# Altium project SAMR21_Xplained_Pro.PrjPCB (part 2 of 2)

## Sheet SAMR21_Xplained_Pro_Antenna.SchDoc: Antenna
size A3; Organization: ATMEL Norway; Address1: Vestre Rosten 79; Address2: N-7075 TILLER; Address3: NORWAY; DocumentNumber: A09-2127; Revision: 3; SheetNumber: 4; SheetTotal: 7; PageSetup: Record=PageOptions|CenterHorizontal=True|CenterVertical=True|PrintScale=0.68|XCorrection=1.00|YCorrection=1.00|PrintKind=0|BorderSize=5000000|LeftOffset=0|BottomOffset=0|Orientation=2|PaperLength=1000|PaperWidth=1000|Scale=100|PaperSource=7|PrintQuality=-4|MediaType=1|DitherType=10|PaperKind=Letter|PrintScaleMode=1
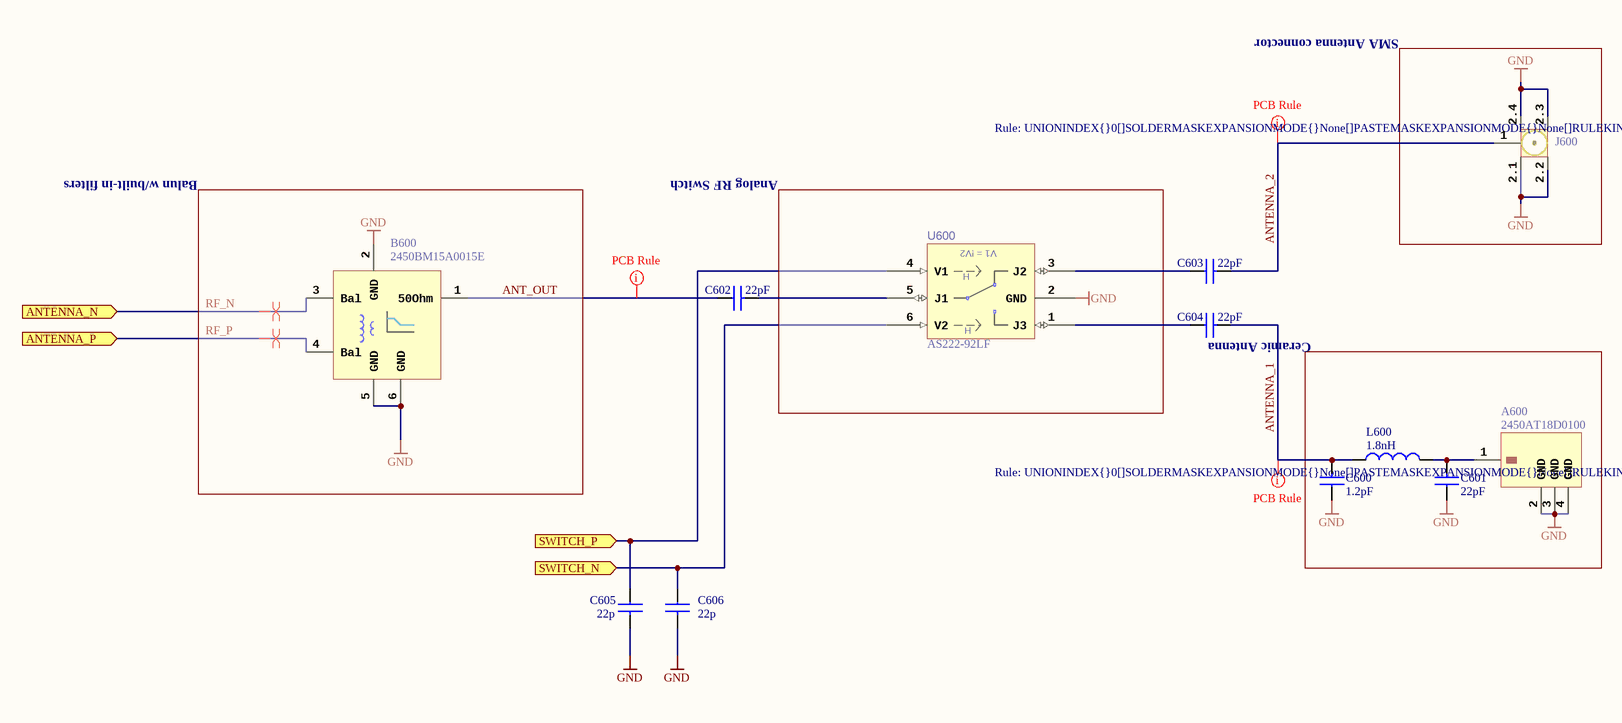
[diagram p6: SAMR21_Xplained_Pro_Antenna.SchDoc]

### Parts
A600  value 2450AT18D0100  [AP8-00678]  (hidden comment: ANT_CERAMIC_4pin)
B600  value 2450BM15A0015E  [AP3-00060]  (hidden comment: New part development in cooperation ATMEL/JTI)
C600  value 1.2pF  [AP1-00035]  (hidden comment: This 1.2pF capacitor is used for RF antennae tuning and can not be replaced by alternatives.)
C601  value 22pF  [AP1-00035]  (hidden comment: This 22pF capacitor cannot be replaced by A01-0311 in ZigBits)
C602  value 22pF  [AP1-00035]  (hidden comment: This 22pF capacitor cannot be replaced by A01-0311 in ZigBits)
C603  value 22pF  [AP1-00035]  (hidden comment: This 22pF capacitor cannot be replaced by A01-0311 in ZigBits)
C604  value 22pF  [AP1-00035]  (hidden comment: This 22pF capacitor cannot be replaced by A01-0311 in ZigBits)
C605  value 22p  [AP1-00001]  (hidden comment: CAP-NONPOL)
C606  value 22p  [AP1-00001]  (hidden comment: CAP-NONPOL)
J600  Footprint fits SPC, Tyco and Johnson components footprint  [AP8-00416]  (value not drawn)
L600  value 1.8nH  [AP2-00028]  (hidden comment: INDUCTOR)
U600  value AS222-92LF  [AP6-00227]  (hidden comment: AS222-92)

### Blocks framed on the sheet
SMA Antenna connector: J600
Balun w/built-in filters: B600
Analog RF Switch: U600
Ceramic Antenna: A600 C600 C601 L600

### Ports
ANTENNA_N (in), ANTENNA_P (in), SWITCH_N (in), SWITCH_P (in)

### Nets
GND: A600.2(GND) A600.3(GND) A600.4(GND) B600.2(GND) B600.5(GND) B600.6(GND) C600.1 C601.1 C605.2 C606.2 J600.2.1(GND1) J600.2.2(GND2) J600.2.3(GND3) J600.2.4(GND4) U600.2(GND)
ANT_OUT: B600.1(50Ohm) C602.1
ANTENNA_1: C600.2 C604.2 L600.2
ANTENNA_2: C603.2 J600.1(Core)
PA09_RFCTRL1: C606.1 U600.6(V2) ; port SWITCH_N
PA12_RFCTRL2: C605.1 U600.4(V1) ; port SWITCH_P
RF_N: B600.3(Bal) ; port ANTENNA_N
RF_P: B600.4(Bal) ; port ANTENNA_P
NetA600_1: A600.1(A) C601.2 L600.1
NetC602_2: C602.2 U600.5(J1)
NetC603_1: C603.1 U600.3(J2)
NetC604_1: C604.1 U600.1(J3)

### Layout directives
differential pair: RF_N, RF_P
rule Impedance Constraint [Min = 48.00    Max = 52.00    ]: ANT_OUT, ANTENNA_1, ANTENNA_2

### Notes on the sheet
- Date:
- PAGE:
- of
- TITLE:
- Document number:
- Revision:
- (in symbol A06-0560) V1 = !V2; H

### Library data of the parts
A600 = A08-1618: 2.45 GHz Ceramic Antenna; PartGroup: Mechanical devices,Antenna; Manufacturer: Johanson Technology; TemperatureRange: -40 to +85°C; AN: A08-1618; Height: 1.39999997615814; MPN: 2450AT18D0100
B600 = A03-0091: Filtered Balun to match AT86RF232/233 (35288); PartGroup: Inductors,RF,Other RF; Manufacturer: Johanson Technology; AN: A03-0091; Height: 0,800000011920929; MPN: 2450BM15A0015E
C600 = A01-0612: Ceramic Capacitor, SMD 0201, 25V, NP0, 1.2pF; PartGroup: Capacitors,Ceramic,SMD 0201; AN: A01-0612
C601-C604 = A01-0335: Ceramic Capacitor, SMD 0201, 25V, NP0, 22PF; PartGroup: Capacitors,Ceramic,SMD 0201; Manufacturer: Johanson Technology; MPN: 250R05L220JV4T; AN: A01-0335
C605 C606 = A01-0019: Ceramic capacitor, SMD 0402, NP0, 50V, +/-5%; PartGroup: Capacitors,Ceramic,SMD 0402; TemperatureRange: -55 - +125 deg C; AN: A01-0019; Tolerance: 50V, +/-5%; Height: 0.550000011920929
J600 = A08-0963: SMA PCB mounted connector 50Ohm (de19205); PartGroup: Mechanical devices,Connectors,Coaxial; Manufacturer: Multicomp; Value: 19-46-1-TGG; TemperatureRange: -65 - +165 deg C; AN: A08-0963; MPN: 19-46-1-TGG; Height: 13
L600 = A03-0148: ceramic chip inductor, 1.8nH,0201; PartGroup: Inductors,RF,SMD 0201; Manufacturer: Johanson Technology; MPN: L-05B1N8SV6T; Tolerance: ±0.3nH; TemperatureRange: -40°C ~ 100°C; AN: A03-0148
U600 = A06-0560: PHEMT SPDT Analog SWITCH, 0,1-3 GHz; PartGroup: Integrated Circuits,General linear,Analog switch, bus switch and MUX; Manufacturer: SKYWORKS SOLUTIONS; TemperatureRange: -40°C to +85°C; AN: A06-0560; Height: 0,949999988079071; MPN: AS222-92LF

## Nets that join several sheets
GND: SAMR21_Xplained_Pro_Target_MCU (30 pins), SAMR21_Xplained_Pro_Crystals (7 pins), SAMR21_Xplained_Pro_EDBG (33 pins), SAMR21_Xplained_Pro_Connectors (J200.2 J200.19 J202.2 J202.19), SAMR21_Xplained_Pro_triple_input_power_supply (16 pins), SAMR21_Xplained_Pro_Antenna (15 pins)
VCC_EDBG_USB_P5V0: SAMR21_Xplained_Pro_EDBG (C408.1 L401.2 U400.A10), SAMR21_Xplained_Pro_triple_input_power_supply (C102.1 R104.2 U101.3 U101.8)
VCC_MCU_P3V3: SAMR21_Xplained_Pro_Target_MCU (9 pins), SAMR21_Xplained_Pro_triple_input_power_supply (J101.1)
VCC_P3V3: SAMR21_Xplained_Pro_EDBG (R425.2), SAMR21_Xplained_Pro_triple_input_power_supply (C100.1 R102.1 R108.1 U100.5)
VCC_TARGET_P3V3: SAMR21_Xplained_Pro_Target_MCU (J303.1 R300.2 R303.2), SAMR21_Xplained_Pro_Connectors (J200.20 J202.20), SAMR21_Xplained_Pro_triple_input_power_supply (J100.4 J101.2 R108.2 R109.2)
VCC_TARGET_USB_P5V0: SAMR21_Xplained_Pro_Target_MCU (D300.4 J300.1 R328.2), SAMR21_Xplained_Pro_triple_input_power_supply (C103.1 R105.2 U101.6)
EDBG_ADC0: SAMR21_Xplained_Pro_EDBG (U400.K10), SAMR21_Xplained_Pro_triple_input_power_supply (R109.1 R110.2)
EDBG_CDC_USART_RX: SAMR21_Xplained_Pro_Target_MCU (R316.1), SAMR21_Xplained_Pro_EDBG (U400.F9)
EDBG_DGI_SCL: SAMR21_Xplained_Pro_Target_MCU (R315.1), SAMR21_Xplained_Pro_EDBG (U400.F7)
EDBG_DGI_SDA: SAMR21_Xplained_Pro_Target_MCU (R314.1), SAMR21_Xplained_Pro_EDBG (U400.G7)
EDBG_SPI_DGI_MOSI: SAMR21_Xplained_Pro_Target_MCU (R312.1), SAMR21_Xplained_Pro_EDBG (U400.K3)
EDBG_SPI_DGI_SCK: SAMR21_Xplained_Pro_Target_MCU (R311.1), SAMR21_Xplained_Pro_EDBG (U400.J4)
EDBG_SPI_DGI_SS: SAMR21_Xplained_Pro_Target_MCU (R310.1), SAMR21_Xplained_Pro_EDBG (U400.G5)
ID1: SAMR21_Xplained_Pro_EDBG (R409.1 U400.A1), SAMR21_Xplained_Pro_Connectors (J200.1)
ID3: SAMR21_Xplained_Pro_EDBG (R401.1 U400.B3), SAMR21_Xplained_Pro_Connectors (J202.1)
NetJ200_4: SAMR21_Xplained_Pro_Target_MCU (R332.2), SAMR21_Xplained_Pro_Connectors (J200.4)
NetR313_1: SAMR21_Xplained_Pro_Target_MCU (R313.1), SAMR21_Xplained_Pro_EDBG (R420.2)
NetR317_1: SAMR21_Xplained_Pro_Target_MCU (R317.1), SAMR21_Xplained_Pro_EDBG (R414.1)
NetR318_1: SAMR21_Xplained_Pro_Target_MCU (R318.1), SAMR21_Xplained_Pro_EDBG (R416.1)
NetR319_1: SAMR21_Xplained_Pro_Target_MCU (R319.1), SAMR21_Xplained_Pro_EDBG (R417.1)
NetR320_1: SAMR21_Xplained_Pro_Target_MCU (R320.1), SAMR21_Xplained_Pro_EDBG (R418.1)
NetR321_1: SAMR21_Xplained_Pro_Target_MCU (R321.1), SAMR21_Xplained_Pro_EDBG (R419.1)
PA00_XIN32: SAMR21_Xplained_Pro_Target_MCU (U300.1), SAMR21_Xplained_Pro_Crystals (C310.1 XC301.2)
PA01_XOUT32: SAMR21_Xplained_Pro_Target_MCU (U300.2), SAMR21_Xplained_Pro_Crystals (C309.1 J301.2)
PA04_S0_UART_TX: SAMR21_Xplained_Pro_Target_MCU (R316.2 U300.9), SAMR21_Xplained_Pro_Connectors (J200.14)
PA05_S0_UART_RX: SAMR21_Xplained_Pro_Target_MCU (R317.2 U300.10), SAMR21_Xplained_Pro_Connectors (J200.13)
PA06_ADC6: SAMR21_Xplained_Pro_Target_MCU (U300.11), SAMR21_Xplained_Pro_Connectors (J200.3)
PA08_GPIO: SAMR21_Xplained_Pro_Target_MCU (R318.2 U300.15), SAMR21_Xplained_Pro_Connectors (J202.10)
PA09_RFCTRL1: SAMR21_Xplained_Pro_Target_MCU (J304.1 R319.2 U300.16), SAMR21_Xplained_Pro_Antenna (C606.1 U600.6)
PA12_RFCTRL2: SAMR21_Xplained_Pro_Target_MCU (J304.2 R320.2 U300.21), SAMR21_Xplained_Pro_Antenna (C605.1 U600.4)
PA13_GPIO: SAMR21_Xplained_Pro_Target_MCU (U300.22), SAMR21_Xplained_Pro_Connectors (J200.5)
PA14_GPIO: SAMR21_Xplained_Pro_Target_MCU (R321.2 U300.23), SAMR21_Xplained_Pro_Connectors (J202.15)
PA15_GPIO: SAMR21_Xplained_Pro_Target_MCU (U300.24), SAMR21_Xplained_Pro_Connectors (J202.5)
PA16_S1_I2C_SDA: SAMR21_Xplained_Pro_Target_MCU (R314.2 R326.2 U300.25), SAMR21_Xplained_Pro_Connectors (J200.11 J202.11)
PA17_S1_I2C_SCL: SAMR21_Xplained_Pro_Target_MCU (R315.2 R327.2 U300.26), SAMR21_Xplained_Pro_Connectors (J200.12 J202.12)
PA18_PWM_T0_W2: SAMR21_Xplained_Pro_Target_MCU (U300.27), SAMR21_Xplained_Pro_Connectors (J200.7)
PA19_PWM_T0_W3: SAMR21_Xplained_Pro_Target_MCU (R301.1 U300.28), SAMR21_Xplained_Pro_Connectors (J200.8)
PA22_GPIO: SAMR21_Xplained_Pro_Target_MCU (U300.31), SAMR21_Xplained_Pro_Connectors (J200.9)
PA23_GPIO: SAMR21_Xplained_Pro_Target_MCU (U300.32), SAMR21_Xplained_Pro_Connectors (J200.10)
PA28_GPIO: SAMR21_Xplained_Pro_Target_MCU (R306.1 U300.41), SAMR21_Xplained_Pro_Connectors (J200.6)
PB02_S5_SPI_MISO: SAMR21_Xplained_Pro_Target_MCU (R313.2 U300.47), SAMR21_Xplained_Pro_Connectors (J200.17 J202.17)
PB03_S5_SPI_SS: SAMR21_Xplained_Pro_Target_MCU (U300.48), SAMR21_Xplained_Pro_Connectors (J200.15)
PB22_S5_SPI_MOSI: SAMR21_Xplained_Pro_Target_MCU (R312.2 U300.37), SAMR21_Xplained_Pro_Connectors (J200.16 J202.16)
PB23_S5_SPI_SCK_EXT1: SAMR21_Xplained_Pro_Target_MCU (R307.2), SAMR21_Xplained_Pro_Connectors (J200.18)
PB23_S5_SPI_SCK_EXT3: SAMR21_Xplained_Pro_Target_MCU (R308.2), SAMR21_Xplained_Pro_Connectors (J202.18)
RF233_XTAL1: SAMR21_Xplained_Pro_Target_MCU (U300.4), SAMR21_Xplained_Pro_Crystals (C305.2 XC300.3)
RF233_XTAL2: SAMR21_Xplained_Pro_Target_MCU (U300.3), SAMR21_Xplained_Pro_Crystals (C300.2 J302.2)
RF_N: SAMR21_Xplained_Pro_Target_MCU (U300.19), SAMR21_Xplained_Pro_Antenna (B600.3)
RF_P: SAMR21_Xplained_Pro_Target_MCU (U300.18), SAMR21_Xplained_Pro_Antenna (B600.4)
SWCLK: SAMR21_Xplained_Pro_Target_MCU (R323.1), SAMR21_Xplained_Pro_EDBG (U400.D6)
SWDIO: SAMR21_Xplained_Pro_Target_MCU (R322.1), SAMR21_Xplained_Pro_EDBG (U400.C5)
TARGET_RESET_EDBG: SAMR21_Xplained_Pro_Target_MCU (R324.1), SAMR21_Xplained_Pro_EDBG (U400.B4)
TARGET_RESET_SENSE: SAMR21_Xplained_Pro_Target_MCU (R325.2), SAMR21_Xplained_Pro_EDBG (U400.H2)

## Assembly variants
Default_assembly: not fitted C302 C403 C601 J303 J304 R305 R424
Variant of SAMR21_Xplained_Pro: not fitted C302 C403 C601 J304 R108 R109 R305 R310 R311 R312 R313 R314 R315 R316 R317 R318 R319 R320 R321 R322 R323 R324 R325 R329 R424